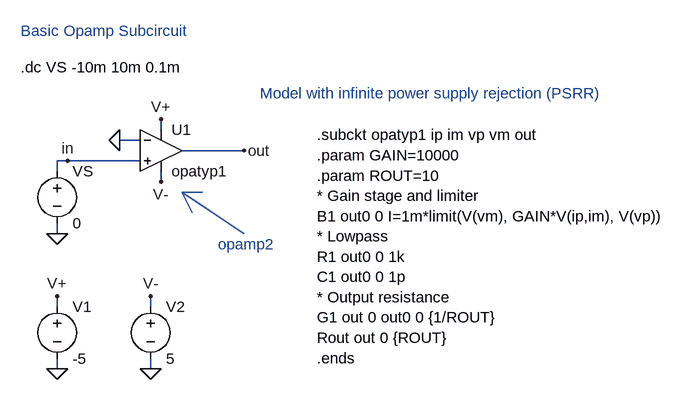
[diagram p0: schematic Basic_opamp1.asc]
Basic_opamp1.asc, the LTspice schematic file:
Version 4
SHEET 1 1504 680
WIRE 128 128 128 112
WIRE 96 144 64 144
WIRE 256 160 160 160
WIRE -16 176 -32 176
WIRE 96 176 -16 176
WIRE -32 192 -32 176
WIRE 128 208 128 192
WIRE -32 288 -32 272
WIRE -32 400 -32 384
WIRE 112 400 112 384
WIRE -32 496 -32 480
WIRE 112 496 112 480
FLAG 64 144 0
FLAG 128 112 V+
FLAG 128 208 V-
FLAG -32 288 0
FLAG -32 496 0
FLAG 112 496 0
FLAG -32 384 V+
FLAG 112 384 V-
FLAG 256 160 out
FLAG -16 176 in
SYMBOL Opamps\\opamp2 128 96 R0
SYMATTR InstName U1
SYMATTR Value opatyp1
SYMBOL voltage -32 384 R0
SYMATTR InstName V1
SYMATTR Value -5
SYMBOL voltage 112 384 R0
SYMATTR InstName V2
SYMATTR Value 5
SYMBOL voltage -32 176 R0
SYMATTR InstName VS
SYMATTR Value 0
TEXT 368 136 Left 0 !.subckt opatyp1 ip im vp vm out\n.param GAIN=10000\n.param ROUT=10\n* Gain stage and limiter\nB1 out0 0 I=1m*limit(V(vm), GAIN*V(ip,im), V(vp))\n* Lowpass\nR1 out0 0 1k\nC1 out0 0 1p\n* Output resistance\nG1 out 0 out0 0 {1/ROUT}\nRout out 0 {ROUT}\n.ends
TEXT -88 32 Left 0 !.dc VS -10m 10m 0.1m
TEXT -88 -24 Left 0 ;Basic Opamp Subcircuit
TEXT 280 72 Left 0 ;Model with infinite power supply rejection (PSRR)
TEXT 216 304 Left 0 ;opamp2
LINE Normal 160 224 256 288
LINE Normal 176 256 160 224
LINE Normal 160 224 176 256
LINE Normal 192 224 160 224

The netlist it stands for:
* Basic_opamp1.asc
XU1 in 0 V+ V- out opatyp1  ; pins In+ In- V+ V- OUT
V1 V+ 0 -5
V2 V- 0 5
VS in 0 0
.subckt opatyp1 ip im vp vm out
.param GAIN=10000
.param ROUT=10
* Gain stage and limiter
B1 out0 0 I=1m*limit(V(vm), GAIN*V(ip,im), V(vp))
* Lowpass
R1 out0 0 1k
C1 out0 0 1p
* Output resistance
G1 out 0 out0 0 {1/ROUT}
Rout out 0 {ROUT}
.ends
.dc VS -10m 10m 0.1m
* Basic Opamp Subcircuit
* Model with infinite power supply rejection (PSRR)
* opamp2
.backanno
.end